# Altium schematic sheet Gas_Sampler-RFD_Radio.SchDoc: Radio
size Tabloid; Organization: Sensible Robotics LLC; Address1: 120 E Church Ave Suite B; Address2: Ridgecrest CA, 93555; Revision: 0; SheetNumber: 2; SheetTotal: 12; ApprovedBy: Approved Name; Engineer: Mike Licitra; PageSetup: Record=PageOptions|CenterHorizontal=True|CenterVertical=True|PrintScale=0.98|XCorrection=1.00|YCorrection=1.00|PrintKind=0|BorderSize=5000000|LeftOffset=0|BottomOffset=0|Orientation=2|PaperLength=1000|PaperWidth=1000|Scale=100|PaperSource=15|PrintQuality=600|MediaType=1|DitherType=10|PaperKind=Tabloid|PrintScaleMode=1
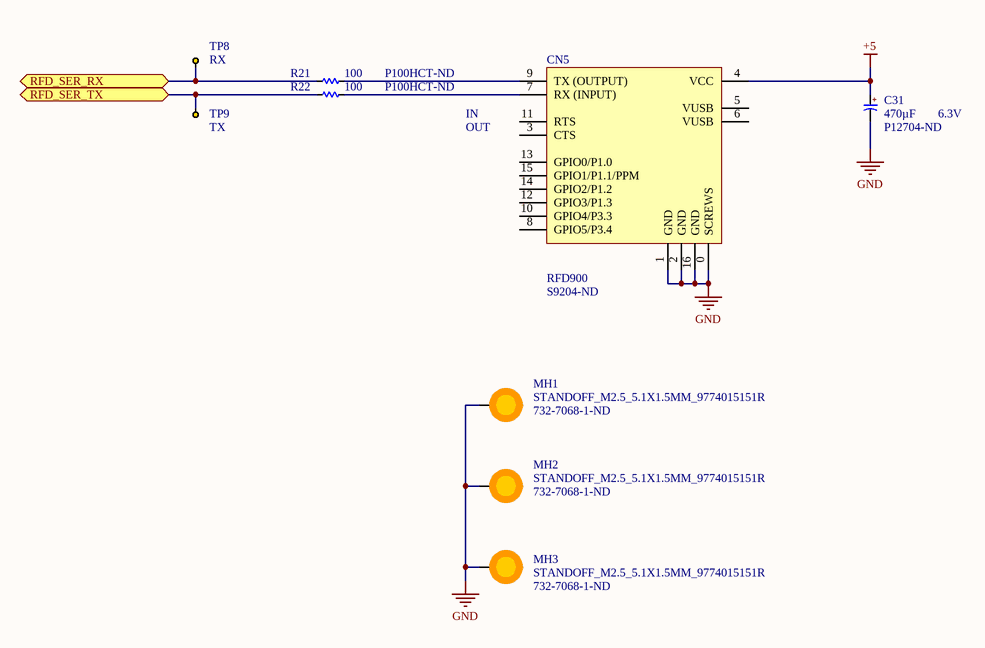
[diagram p0: Gas_Sampler-RFD_Radio.SchDoc]

## Parts
C31  value 470µF  Voltage - Rated: 6.3V  Supplier Part Number 1: P12704-ND  [CAP_RADIAL_8MM_DIA_11.5MM_LEN_3.5MM_LEADSPACE]  (hidden comment: CAP_ALUM_470UF_6.3V_20%_RADIAL_8X11.5MM)
CN5  RFD900  Supplier Part Number 1: S9204-ND  [RFD900_FLAT]
MH1  STANDOFF_M2.5_5.1X1.5MM_9774015151R  Supplier Part Number 1: 732-7068-1-ND  [STANDOFF_M2.5_5.1X1.5MM]
MH2  STANDOFF_M2.5_5.1X1.5MM_9774015151R  Supplier Part Number 1: 732-7068-1-ND  [STANDOFF_M2.5_5.1X1.5MM]
MH3  STANDOFF_M2.5_5.1X1.5MM_9774015151R  Supplier Part Number 1: 732-7068-1-ND  [STANDOFF_M2.5_5.1X1.5MM]
R21  value 100  Supplier Part Number 1: P100HCT-ND  [R0603]  (hidden comment: RES_0603_100_OHM_1/10W_1%)
R22  value 100  Supplier Part Number 1: P100HCT-ND  [R0603]  (hidden comment: RES_0603_100_OHM_1/10W_1%)
TP8  RX  [TP_KEYSTONE_5001]
TP9  TX  [TP_KEYSTONE_5001]

## Ports
RFD_SER_RX, RFD_SER_TX

## Nets
+5: C31.1 CN5.4(VCC)
GND: C31.2 CN5.0(SCREWS) CN5.1(GND) CN5.2(GND) CN5.16(GND) MH1.1 MH2.1 MH3.1
RFD_SER_RX: R21.1 TP8.1 ; port RFD_SER_RX
RFD_SER_TX: R22.1 TP9.1 ; port RFD_SER_TX
NetCN5_7: CN5.7(RX_(INPUT)) R22.2
NetCN5_9: CN5.9(TX_(OUTPUT)) R21.2

Not connected (* = marked no-connect by the designer): CN5 3(CTS) 5(VUSB) 6(VUSB) 8(GPIO5/P3.4) 10(GPIO4/P3.3) 11(RTS) 12(GPIO3/P1.3) 13(GPIO0/P1.0) 14(GPIO2/P1.2) 15(GPIO1/P1.1/PPM)

## Notes on the sheet
- IN
- OUT
- CONFIDENTIAL DOCUMENT
- DUPLICATION PROHIBITED
- ENGINEER
- PCB FAB #
- SCH #
- REV
- Sensible
- Robotics
- THIS DOCUMENT CONTAINS INFORMATION AND OR DATA, WHICH IS PROPRIETARY AND CONFIDENTIAL TO SENSIBLE ROBOTICS LLC.  THIS INFORMATION AND OR DATA, IS TO BE USED ONLY FOR THE BENEFIT OF THE SUPPLIER, AND IS NOT TO BE USED FOR THE BENEFIT OF OTHER PARTIES WITHOUT WRITTEN CONSENT.
- DATE
- PCB ASSY #
- SIZE
- Tabloid
- SHEET
- OF
- FILE
- (in symbol CAP_ALUM_470UF_6.3V_20%_RADIAL_8X11.5MM) +

## Library data of the parts
C31 = CAP_ALUM_470UF_6.3V_20%_RADIAL_8X11.5MM: CAP ALUM 470UF 6.3V 20% RADIAL; Manufacturer: Panasonic Electronic Components; Manufacturer Part Number: EEU-FC0J471; Lifetime @ Temp.: 2000 Hrs @ 105°C; Ripple Current: 555mA; Impedance: 117 mOhm; Supplier 1: Digi-Key; RoHS: RoHS Compliant; Category: Capacitors; Stock 1: 89301; Pricing 1: 1=0.48, 50=0.2352, 100=0.2016, 500=0.1512, 1000=0.12768, 5000=0.11424, 10000=0.10752, 25000=0.1008 (USD); Packaging: Bulk; Tolerance: ±20%; Operating Temperature: -55°C ~ 105°C; Features: General Purpose; ESR (Equivalent Series Resistance): -; Mounting Type: Through Hole; Package / Case: Radial, Can; Size / Dimension: 0.315" Dia (8.00mm); Height - Seated (Max): 0.453" (11.50mm); Lead Spacing: 0.138" (3.50mm); ComponentLink1URL: http://industrial.panasonic.com/www-cgi/jvcr13pz.cgi?E+PZ+3+ABA0022+EEUFC0J471+7+WW; ComponentLink1Description: http://industrial.panasonic.com/www-cgi/jvcr13pz.cgi?E+PZ+3+ABA0022+EEUFC0J471+7+WW
CN5 = RFD900: Manufacturer Part Number: SFH11-PBPC-D08-RA-BK; Manufacturer: Sullins Connector Solutions; Supplier 1: Digikey
MH1-MH3 = STANDOFF_M2.5_5.1X1.5MM_9774015151R: RND STNDFF M2.5X0.45 STEEL 1.5MM; Manufacturer: Wurth Electronics Inc.; Manufacturer Part Number: 9774015151R; Supplier 1: Digikey
R21 R22 = RES_0603_100_OHM_1/10W_1%: RES 100 OHM 1/10W 1% 0603 SMD; Manufacturer: Panasonic Electronic Components; Manufacturer Part Number: ERJ-3EKF1000V; Part Number: 470-00121-00; Power (Watts): 0.1W, 1/10W; Temperature Coefficient: ±100ppm/°C; Supplier 1: Digi-Key; RoHS: RoHS Compliant; Category: Resistors; Stock 1: 1025169; Pricing 1: 1=0.1, 50=0.0138, 100=0.0105, 250=0.0078, 500=0.00576, 1000=0.00384 (USD); Packaging: Cut Tape (CT); Composition: Thick Film; Features: -; Tolerance: ±1%; Package / Case: 0603 (1608 Metric); Supplier Device Package: 0603; Size / Dimension: 0.063" L x 0.031" W (1.60mm x 0.80mm); Height: 0.022" (0.55mm); Number of Terminations: 2; ComponentLink1URL: http://industrial.panasonic.com/www-cgi/jvcr13pz.cgi?E+PZ+3+AOA0002+ERJ3EKF1000V+7+WW; ComponentLink1Description: http://industrial.panasonic.com/www-cgi/jvcr13pz.cgi?E+PZ+3+AOA0002+ERJ3EKF1000V+7+WW
TP8 TP9 = TEST_KEYSTONE5001: PC TEST POINT TH RING; Manufacturer: Keystone Electronics; Manufacturer Part Number: 5001; Part Number: 250-00184-00; Supplier 1: Digi-Key; Supplier Part Number 1: 5001K-ND; RoHS: RoHS Compliant; Category: Test and Measurement; Stock 1: 341830; Pricing 1: 1=0.33, 10=0.309, 50=0.2252, 100=0.2164, 250=0.19432, 500=0.18548, 1000=0.15456, 2500=0.14131, 5000=0.13248 (USD); Packaging: Bulk; Type: PC Test Point, Miniature; Terminal: 0.010" x 0.020" (0.25mm x 0.51mm) Phosphor Bronze Wire, Silver Plate; Mounting Type: 0.040" (1.02mm) Hole Diameter; Material: Base, Nylon 46, UL 94V-0; Color: Black; ComponentLink1URL: http://www.keyelco.com/product-pdf.cfm?p=1310; ComponentLink1Description: http://www.keyelco.com/product-pdf.cfm?p=1310